# Altium schematic sheet DE-180417_02.SchDoc: Microcontroller & Com Board
size A4; Author: eldar6776@hotmail.com; DrawnBy: Eldar Dedić; Organization: I-MEDIA GROUP d.o.o.; Address1: Topal Osman Paše 18; Address2: 71000 Sarajevo; Address3: Federacija BiH; Address4: Bosna i Hercegovina; DocumentNumber: 2; Revision: 001; SheetNumber: 2; SheetTotal: 3; ProjectName: Prekidač Balkonske Rasvjete
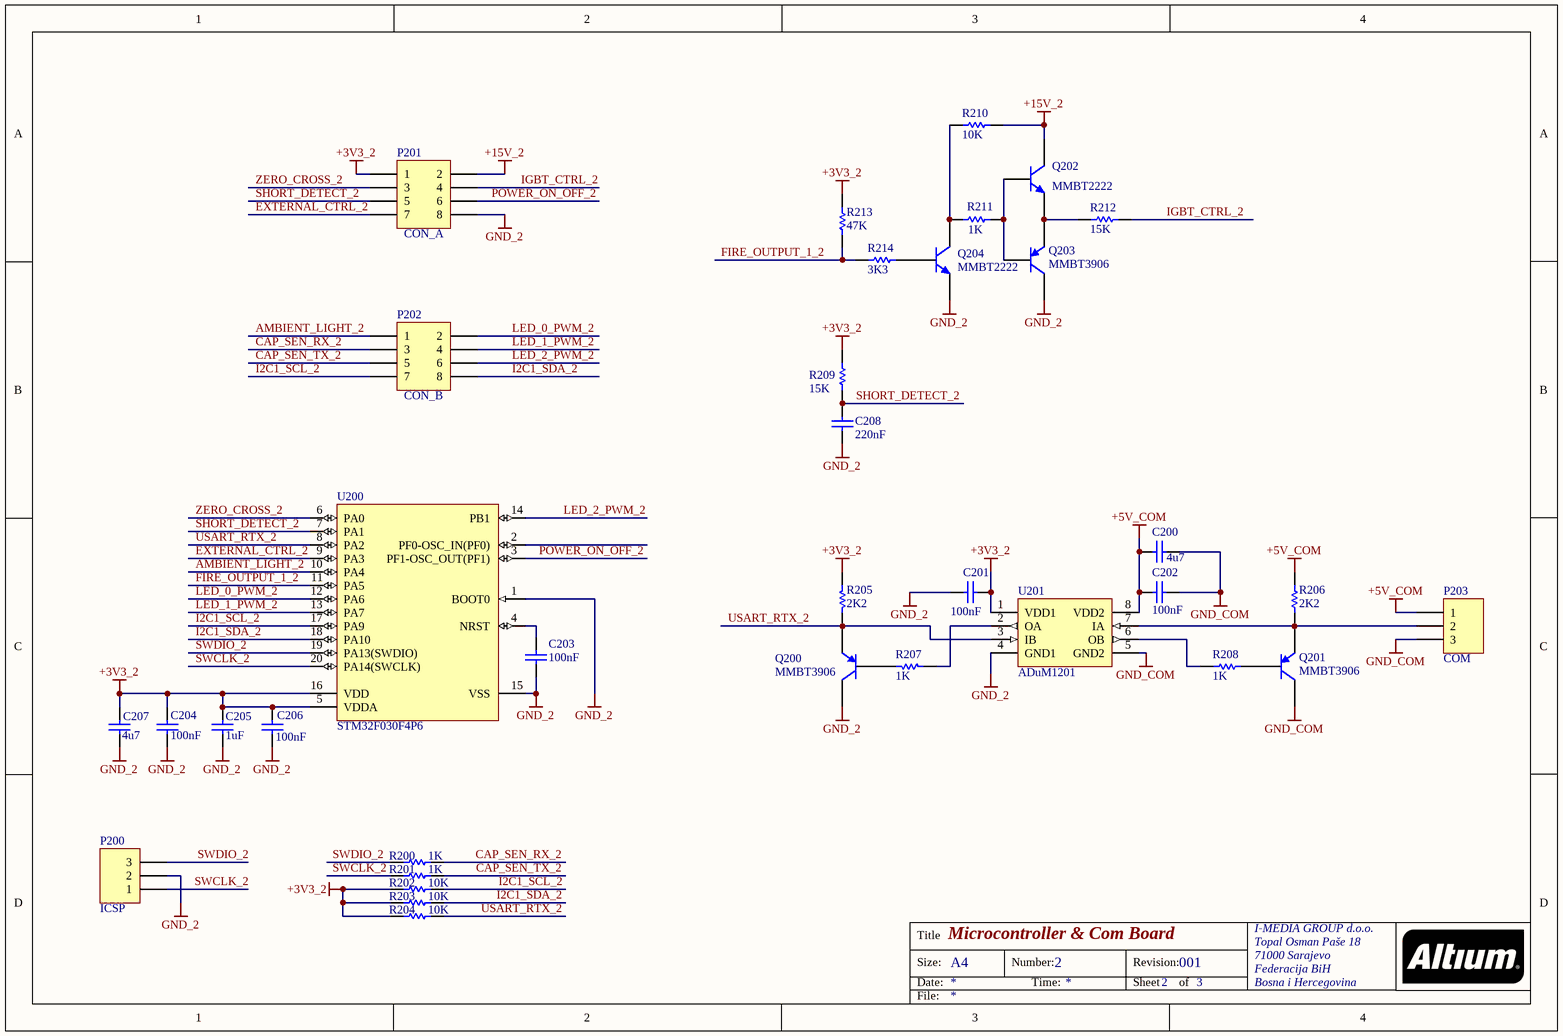
[diagram p0: DE-180417_02.SchDoc]

## Parts
C200  4u7  [0805]
C201  100nF  [0603]
C202  100nF  [0603]
C203  100nF  [0603]
C204  100nF  [0603]
C205  1uF  [0603]
C206  100nF  [0603]
C207  4u7  [0805]
C208  220nF  [0603]
P200  ICSP  [HDR1X3]
P201  CON_A  [HDR2X4]
P202  CON_B  [HDR2X4]
P203  COM  [HDR1X3]
Q200  MMBT3906  [SOT23_N]
Q201  MMBT3906  [SOT23_N]
Q202  MMBT2222  [SOT23_N]
Q203  MMBT3906  [SOT23_N]
Q204  MMBT2222  [SOT23_N]
R200  1K  [ERA-0603]
R201  1K  [ERA-0603]
R202  10K  [ERA-0603]
R203  10K  [ERA-0603]
R204  10K  [ERA-0603]
R205  2K2  [ERA-0603]
R206  2K2  [ERA-0603]
R207  1K  [ERA-0603]
R208  1K  [ERA-0603]
R209  15K  [ERA-0603]
R210  10K  [ERA-0603]
R211  1K  [ERA-0603]
R212  15K  [ERA-0603]
R213  47K  [ERA-0603]
R214  3K3  [ERA-0603]
U200  STM32F030F4P6  [STM-TSSOP20_N]
U201  ADuM1201  [SOP8]

## Nets
+3V3_2: C201.1 C204.1 C205.1 C206.1 C207.1 P201.1 R202.2 R203.2 R204.2 R205.1 R209.2 R213.1 U200.5(VDDA) U200.16(VDD) U201.1(VDD1)
+5V_COM: C200.1 C202.1 P203.1 R206.1 U201.8(VDD2)
+15V_2: P201.2 Q202.3(C) R210.1
GND_2: C201.2 C203.2 C204.2 C205.2 C206.2 C207.2 C208.1 P200.2 P201.8 Q200.3(C) Q203.3(C) Q204.2(E) U200.1(BOOT0) U200.15(VSS) U201.4(GND1)
GND_COM: C200.2 C202.2 P203.3 Q201.3(C) U201.5(GND2)
AMBIENT_LIGHT_2: P202.1 U200.10(PA4)
CAP_SEN_RX_2: P202.3 R200.1
CAP_SEN_TX_2: P202.5 R201.1
EXTERNAL_CTRL_2: P201.7 U200.9(PA3)
FIRE_OUTPUT_1_2: R213.2 R214.2 U200.11(PA5)
I2C1_SCL_2: P202.7 R202.1 U200.17(PA9)
I2C1_SDA_2: P202.8 R203.1 U200.18(PA10)
IGBT_CTRL_2: P201.4 R212.2
LED_0_PWM_2: P202.2 U200.12(PA6)
LED_1_PWM_2: P202.4 U200.13(PA7)
LED_2_PWM_2: P202.6 U200.14(PB1)
POWER_ON_OFF_2: P201.6 U200.3(PF1-OSC_OUT(PF1))
SHORT_DETECT_2: C208.2 P201.5 R209.1 U200.7(PA1)
SWCLK_2: P200.1 R201.2 U200.20(PA14(SWCLK))
SWDIO_2: P200.3 R200.2 U200.19(PA13(SWDIO))
USART_RTX_2: Q200.2(E) R204.1 R205.2 U200.8(PA2) U201.3(IB)
ZERO_CROSS_2: P201.3 U200.6(PA0)
NetC203_1: C203.1 U200.4(NRST)
NetP203_2: P203.2 Q201.2(E) R206.2 U201.7(IA)
NetQ200_1: Q200.1(B) R207.1
NetQ201_1: Q201.1(B) R208.1
NetQ202_1: Q202.1(B) Q203.1(B) R211.1
NetQ202_2: Q202.2(E) Q203.2(E) R212.1
NetQ204_1: Q204.1(B) R214.1
NetQ204_3: Q204.3(C) R210.2 R211.2
NetR207_2: R207.2 U201.2(OA)
NetR208_2: R208.2 U201.6(OB)

Not connected (* = marked no-connect by the designer): U200 2(PF0-OSC_IN(PF0))

## Notes on the sheet
- Title
- Size:
- Date:
- A4
- Number:
- Time:
- Revision:
- Sheet
- of
- File:

## Library data of the parts
C200 C207 = C0805: Ceramic Chip Capacitor - Standard; Note: Footprint corresponds to dimensions for bulk cassette packaging. This case size has tightened tolerances.; Published: 17-Jul-2002; LatestRevisionDate: 19-Mar-2004; LatestRevisionNote: Silkscreen size reduced.; DatasheetDocument: Mar-2001; PackageDocument: Mar-2001; PackageReference: 0805; Publisher: Altium Limited; Code_JEITA: 0805; Code_IPC: 2012[0805]; ComponentLink1Description: Manufacturer Link; ComponentLink1URL: http://www.kemet.com/; ComponentLink2Description: Datasheet; ComponentLink2URL: http://www.kemet.com/kemet/web/homepage/kechome.nsf/vapubfilesname/F3102TA.pdf/$file/F3102TA.pdf; Value: 4u7
C201-C205 C208 = C0603: Ceramic Chip Capacitor - Standard; Note: Footprint corresponds to dimensions for bulk cassette packaging. This case size has tightened tolerances.; Published: 17-Jul-2002; LatestRevisionDate: 19-Mar-2004; LatestRevisionNote: Silkscreen size reduced.; DatasheetDocument: Mar-2001; PackageDocument: Mar-2001; PackageReference: 0603; Publisher: Altium Limited; Code_JEITA: 0603; Code_IPC: 1608 [0603]; ComponentLink1Description: Manufacturer Link; ComponentLink1URL: http://www.kemet.com/; ComponentLink2Description: Datasheet; ComponentLink2URL: http://www.kemet.com/kemet/web/homepage/kechome.nsf/vapubfilesname/F3102TA.pdf/$file/F3102TA.pdf
  C203 C204: Value: 100nF
  C205: Value: 1uF
C206 = C0603: Ceramic Chip Capacitor - Standard; Note: Footprint corresponds to dimensions for bulk cassette packaging. This case size has tightened tolerances.; Value: 10nF; Published: 17-Jul-2002; LatestRevisionDate: 19-Mar-2004; LatestRevisionNote: Silkscreen size reduced.; DatasheetDocument: Mar-2001; PackageDocument: Mar-2001; PackageReference: 0603; Publisher: Altium Limited; Code_JEITA: 0603; Code_IPC: 1608 [0603]; ComponentLink1Description: Manufacturer Link; ComponentLink1URL: http://www.kemet.com/; ComponentLink2Description: Datasheet; ComponentLink2URL: http://www.kemet.com/kemet/web/homepage/kechome.nsf/vapubfilesname/F3102TA.pdf/$file/F3102TA.pdf
P200 P203 = Header 3: Header, 3-Pin; LatestRevisionDate: 17-Jul-2002; LatestRevisionNote: Re-released for DXP Platform.; Publisher: Altium Limited
P201 P202 = Header 4X2: Header, 4-Pin, Dual row; LatestRevisionDate: 17-Jul-2002; LatestRevisionNote: Re-released for DXP Platform.; Publisher: Altium Limited
Q200 Q201 Q203 = BC807: PNP General-purpose Transistor; Published: 17-Sep-2003; LatestRevisionDate: 12-Dec-2006; LatestRevisionNote: IPC-7351 Footprint Added.; DatasheetVersion: 8-Apr-1999; PackageVersion: May-1999; PackageReference: SOT23; Publisher: Altium Limited; PackageDescription: 3-Pin SOT-23 Package 0.95 mm Pitch, 2.3 mm Lead Span; ComponentLink1Description: Manufacturer Link; ComponentLink1URL: http://www.semiconductors.philips.com/; ComponentLink2Description: Datasheet; ComponentLink2URL: http://www.semiconductors.philips.com/acrobat/datasheets/BC807_BC807W_BC327_5.pdf
Q202 Q204 = BC817: NPN General-purpose Transistor; Published: 17-Sep-2003; LatestRevisionDate: 12-Dec-2006; LatestRevisionNote: IPC-7351 Footprint Added.; DatasheetVersion: Jun-1999; PackageVersion: May-1999; PackageReference: SOT23; Publisher: Altium Limited; PackageDescription: 3-Pin SOT-23 Package 0.95 mm Pitch, 2.3 mm Lead Span; ComponentLink1Description: Manufacturer Link; ComponentLink1URL: http://www.semiconductors.philips.com/; ComponentLink2Description: Datasheet; ComponentLink2URL: http://www.semiconductors.philips.com/acrobat/datasheets/BC817_BC817W_BC337_5.pdf
R200-R214 = ERAV: Metal Film Thermosensitive Chip Resistor, 0.56 Ohm to 10k Ohm Range, 5% Tolerance, 0603 Size, 0.063 W; Note: If flow soldering, adjust pad width of PCB Footprint to 0.7 - 0.8 times the width of the resistor.; Published: 17-Dec-2003; LatestRevisionDate: 19-Mar-2004; LatestRevisionNote: Silkscreen size reduced.; PackageDocument: Mar-2003; PackageReference: ERA-0603; Publisher: Altium Limited; Code_IPC: 1608 [0603]; ComponentLink1Description: Manufacturer Link; ComponentLink1URL: http://www.panasonic.com/industrial/components/resistive_products.htm; ComponentLink2Description: Datasheet; ComponentLink2URL: http://www.panasonic.com/industrial/components/pdf/AOF0000CE1.pdf
U200 = STM32F030F4P6: ARM Cortex-M0 32-bit MCU, 16 KB Flash, 4 KB Internal RAM, 15 I/Os, 20-pin TSSOP, -40 to 85 degC, Tube; FLASH Size (Prog) (kB): 16; I/Os (High Current): 15; Internal RAM Size (kB): 4; Operating Frequency(F) (Processor speed) (MHz): 48; Supply Voltage(Vcc) min (V): 2.4; DatasheetVersion: Rev. 1; PackageVersion: Rev. 1, 11/2012; PackageReference: TSSOP20; PackageDescription: 20-Pin Thin Shrink Small Outline Package, 6.5 x 4.4 mm Body, 0.65 mm Pitch; Supplier 1: Digi-Key; Supplier Part Number 1: 497-14044-5-ND; Supplier 2: Newark; Supplier Part Number 2: 06X3648; Supplier 3: Mouser; Supplier Part Number 3: 511-STM32F030F4P6; Core: ARM Cortex-M0; Packing: Tube; Mounting Technology: Surface Mount; PartNumber: STM32F030F4P6; ComponentLink1Description: Manufacturer URL; ComponentLink1URL: http://www.st.com/web/en/home.html; ComponentLink2Description: Datasheet; ComponentLink2URL: http://www.st.com/st-web-ui/static/active/en/resource/technical/document/datasheet/DM00088500.pdf; ComponentLink3Description: Package Specification; ComponentLink3URL: http://www.st.com/st-web-ui/static/active/en/resource/technical/document/datasheet/DM00065136.pdf
U201 = ADuM1201: Digital Isolator